# Altium project Sidekick Carrier - Rev. 1.PrjPcb (part 1 of 6)
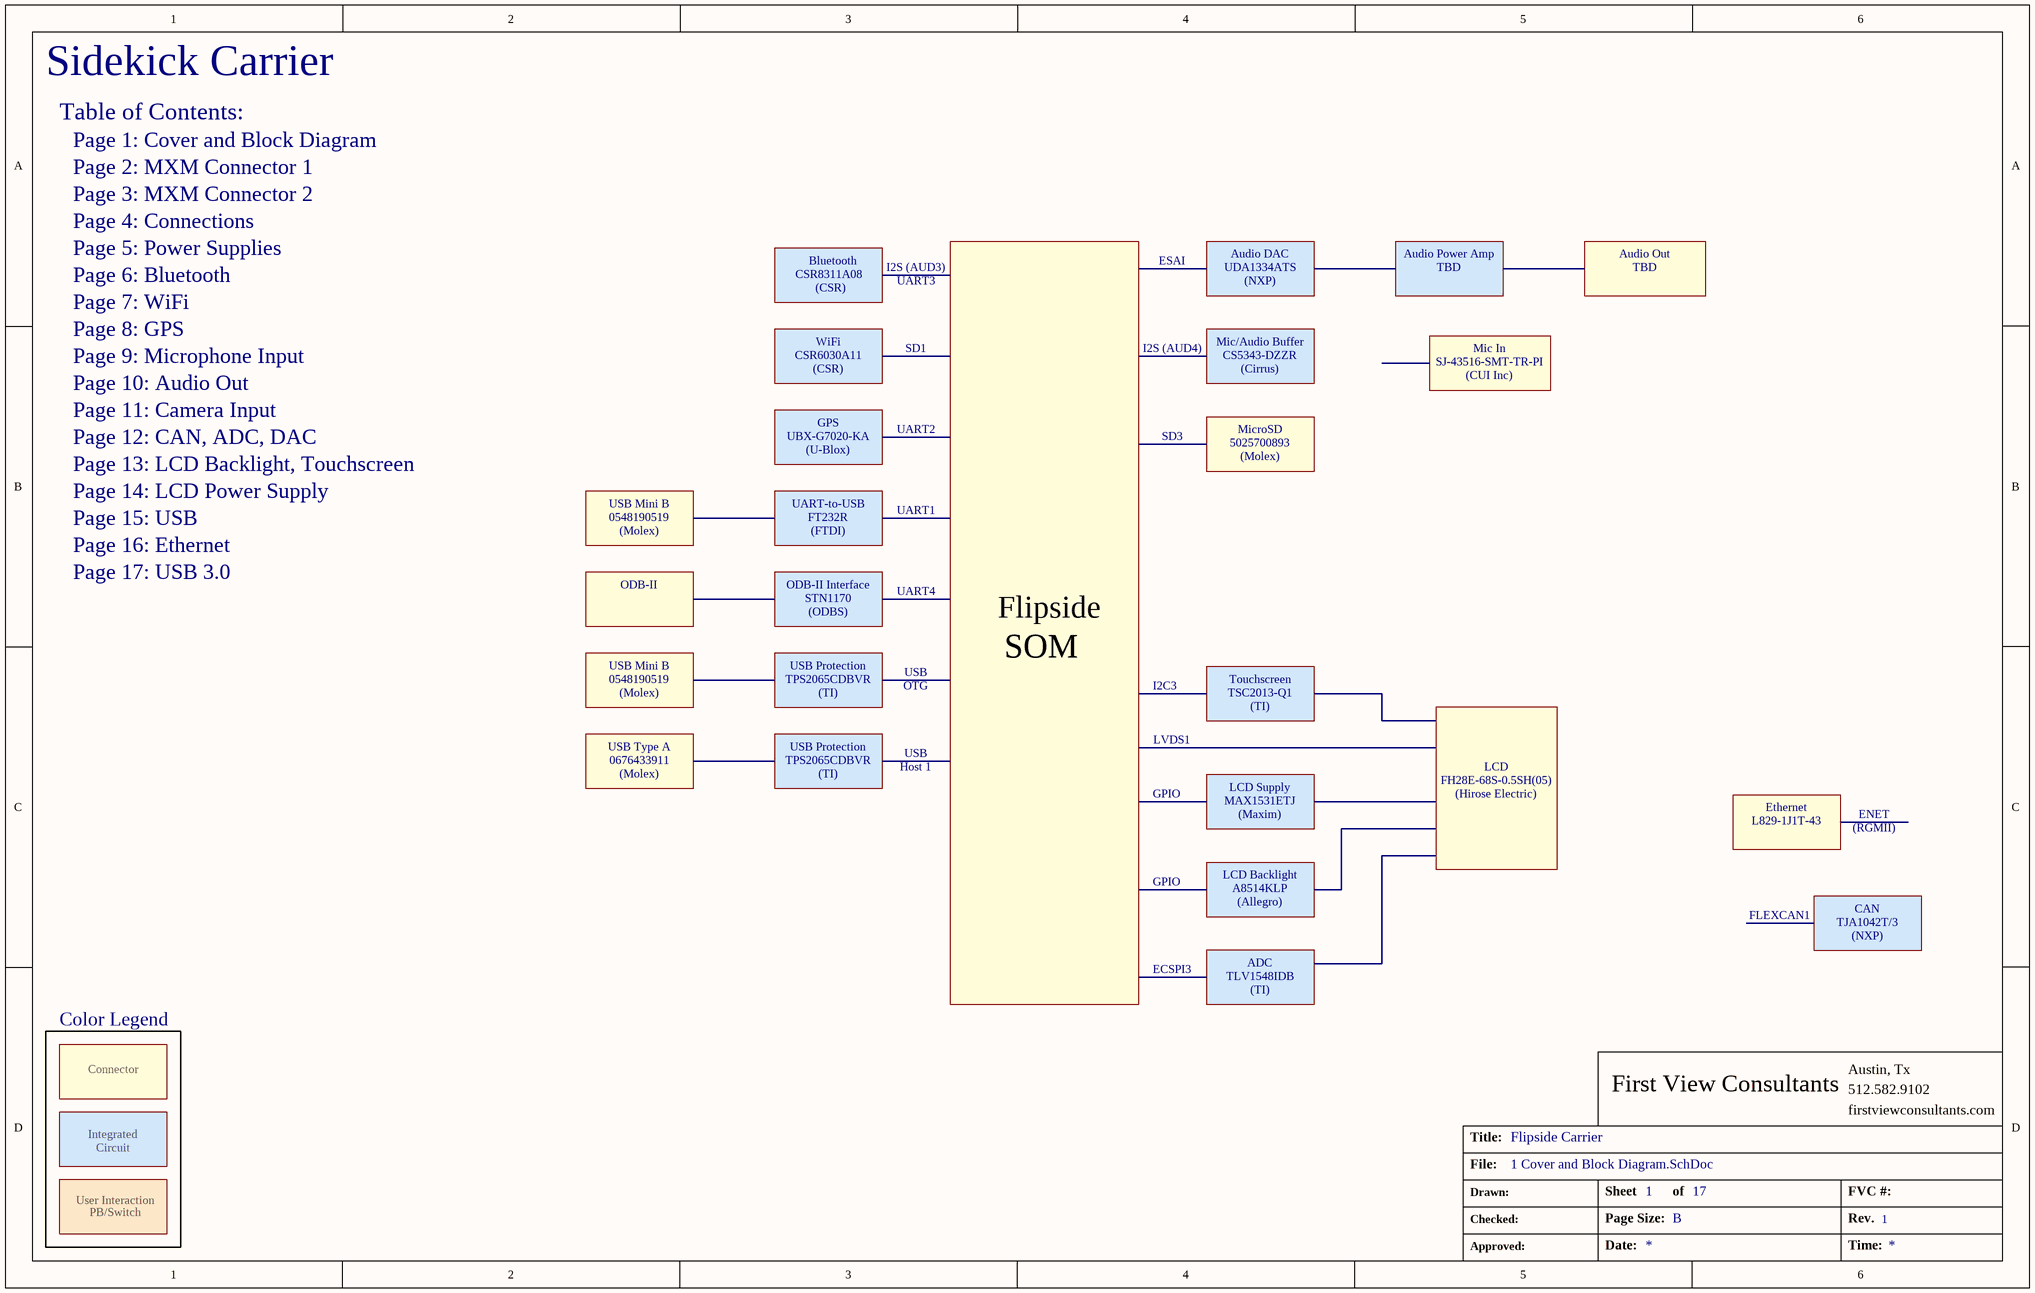
[diagram p0: 1 Cover and Block Diagram.SchDoc]
FV_Project_Title: Flipside Carrier; FV_Revision: 1
17 sheets, 951 parts. Net scope: flat (ports and power ports of the same name join across sheets).
Sheets:
  1 Cover and Block Diagram.SchDoc
  2 MXM Connector 1.SchDoc
  3 MXM Connector 2.SchDoc
  4 Connectors.SchDoc
  5 Power Supplies.SchDoc
  6 Bluetooth.SchDoc
  7 WiFi.SchDoc
  8 GPS.SchDoc
  9 Microphone Input.SchDoc
  10 Audio Out.SchDoc
  11 Camera Input.SchDoc
  12 CAN, ADC, DAC.SchDoc
  13 LCD Backlight, Touchscreen.SchDoc
  14 LCD Power Supply.SchDoc
  15 USB.SchDoc
  16 Ethernet.SchDoc
  17 USB 3.0.SchDoc

## Sheet 1 Cover and Block Diagram.SchDoc: Cover
size B; DocumentNumber: 1; SheetNumber: 1; SheetTotal: 17

### Notes on the sheet
- Sidekick Carrier
- Table of Contents:
- Page 1: Cover and Block Diagram
- Page 2: MXM Connector 1
- Page 4: Connections
- Page 3: MXM Connector 2
- Page 5: Power Supplies
- Page 6: Bluetooth
- CSR8311A08
- Bluetooth
- (CSR)
- I2S (AUD3)
- UART3
- ESAI
- Audio DAC
- UDA1334ATS
- (NXP)
- Audio Power Amp
- TBD
- Audio Out
- Page 7: WiFi
- Page 8: GPS
- Page 9: Microphone Input
- WiFi
- CSR6030A11
- SD1
- I2S (AUD4)
- Mic/Audio Buffer
- CS5343-DZZR
- (Cirrus)
- Mic In
- SJ-43516-SMT-TR-PI
- Page 10: Audio Out
- Page 11: Camera Input
- GPS
- UART2
- MicroSD
- (CUI Inc)
- Page 12: CAN, ADC, DAC
- Page 13: LCD Backlight, Touchscreen
- Page 14: LCD Power Supply
- USB Mini B
- UBX-G7020-KA
- (U-Blox)
- UART-to-USB
- SD3
- 5025700893
- (Molex)
- Page 15: USB
- Page 16: Ethernet
- 0548190519
- FT232R
- (FTDI)
- UART1
- Page 17: USB 3.0
- ODB-II
- ODB-II Interface
- STN1170
- (ODBS)
- UART4
- Flipside
- USB Protection
- TPS2065CDBVR
- (TI)
- USB
- OTG
- SOM
- I2C3
- Touchscreen
- TSC2013-Q1
- USB Type A
- 0676433911
- Host 1
- LVDS1
- LCD
- GPIO
- LCD Supply
- MAX1531ETJ
- (Maxim)
- FH28E-68S-0.5SH(05)
- (Hirose Electric)
- Ethernet
- L829-1J1T-43
- ENET
- (RGMII)
- LCD Backlight
- A8514KLP
- (Allegro)
- CAN
- ECSPI3
- ADC
- FLEXCAN1
- TJA1042T/3
- Color Legend
- TLV1548IDB
- Connector
- Integrated
- Circuit
- User Interaction
- PB/Switch
- First View Consultants
- Austin, Tx
- 512.582.9102
- Title:
- File:
- firstviewconsultants.com
- Drawn:
- Checked:
- Sheet
- Page Size:
- of
- B
- FVC #:
- Rev.
- Approved:
- Date:
- Time:

## Sheet 2 MXM Connector 1.SchDoc: MXM Connector
size C; DocumentNumber: 2; SheetNumber: 2; SheetTotal: 17
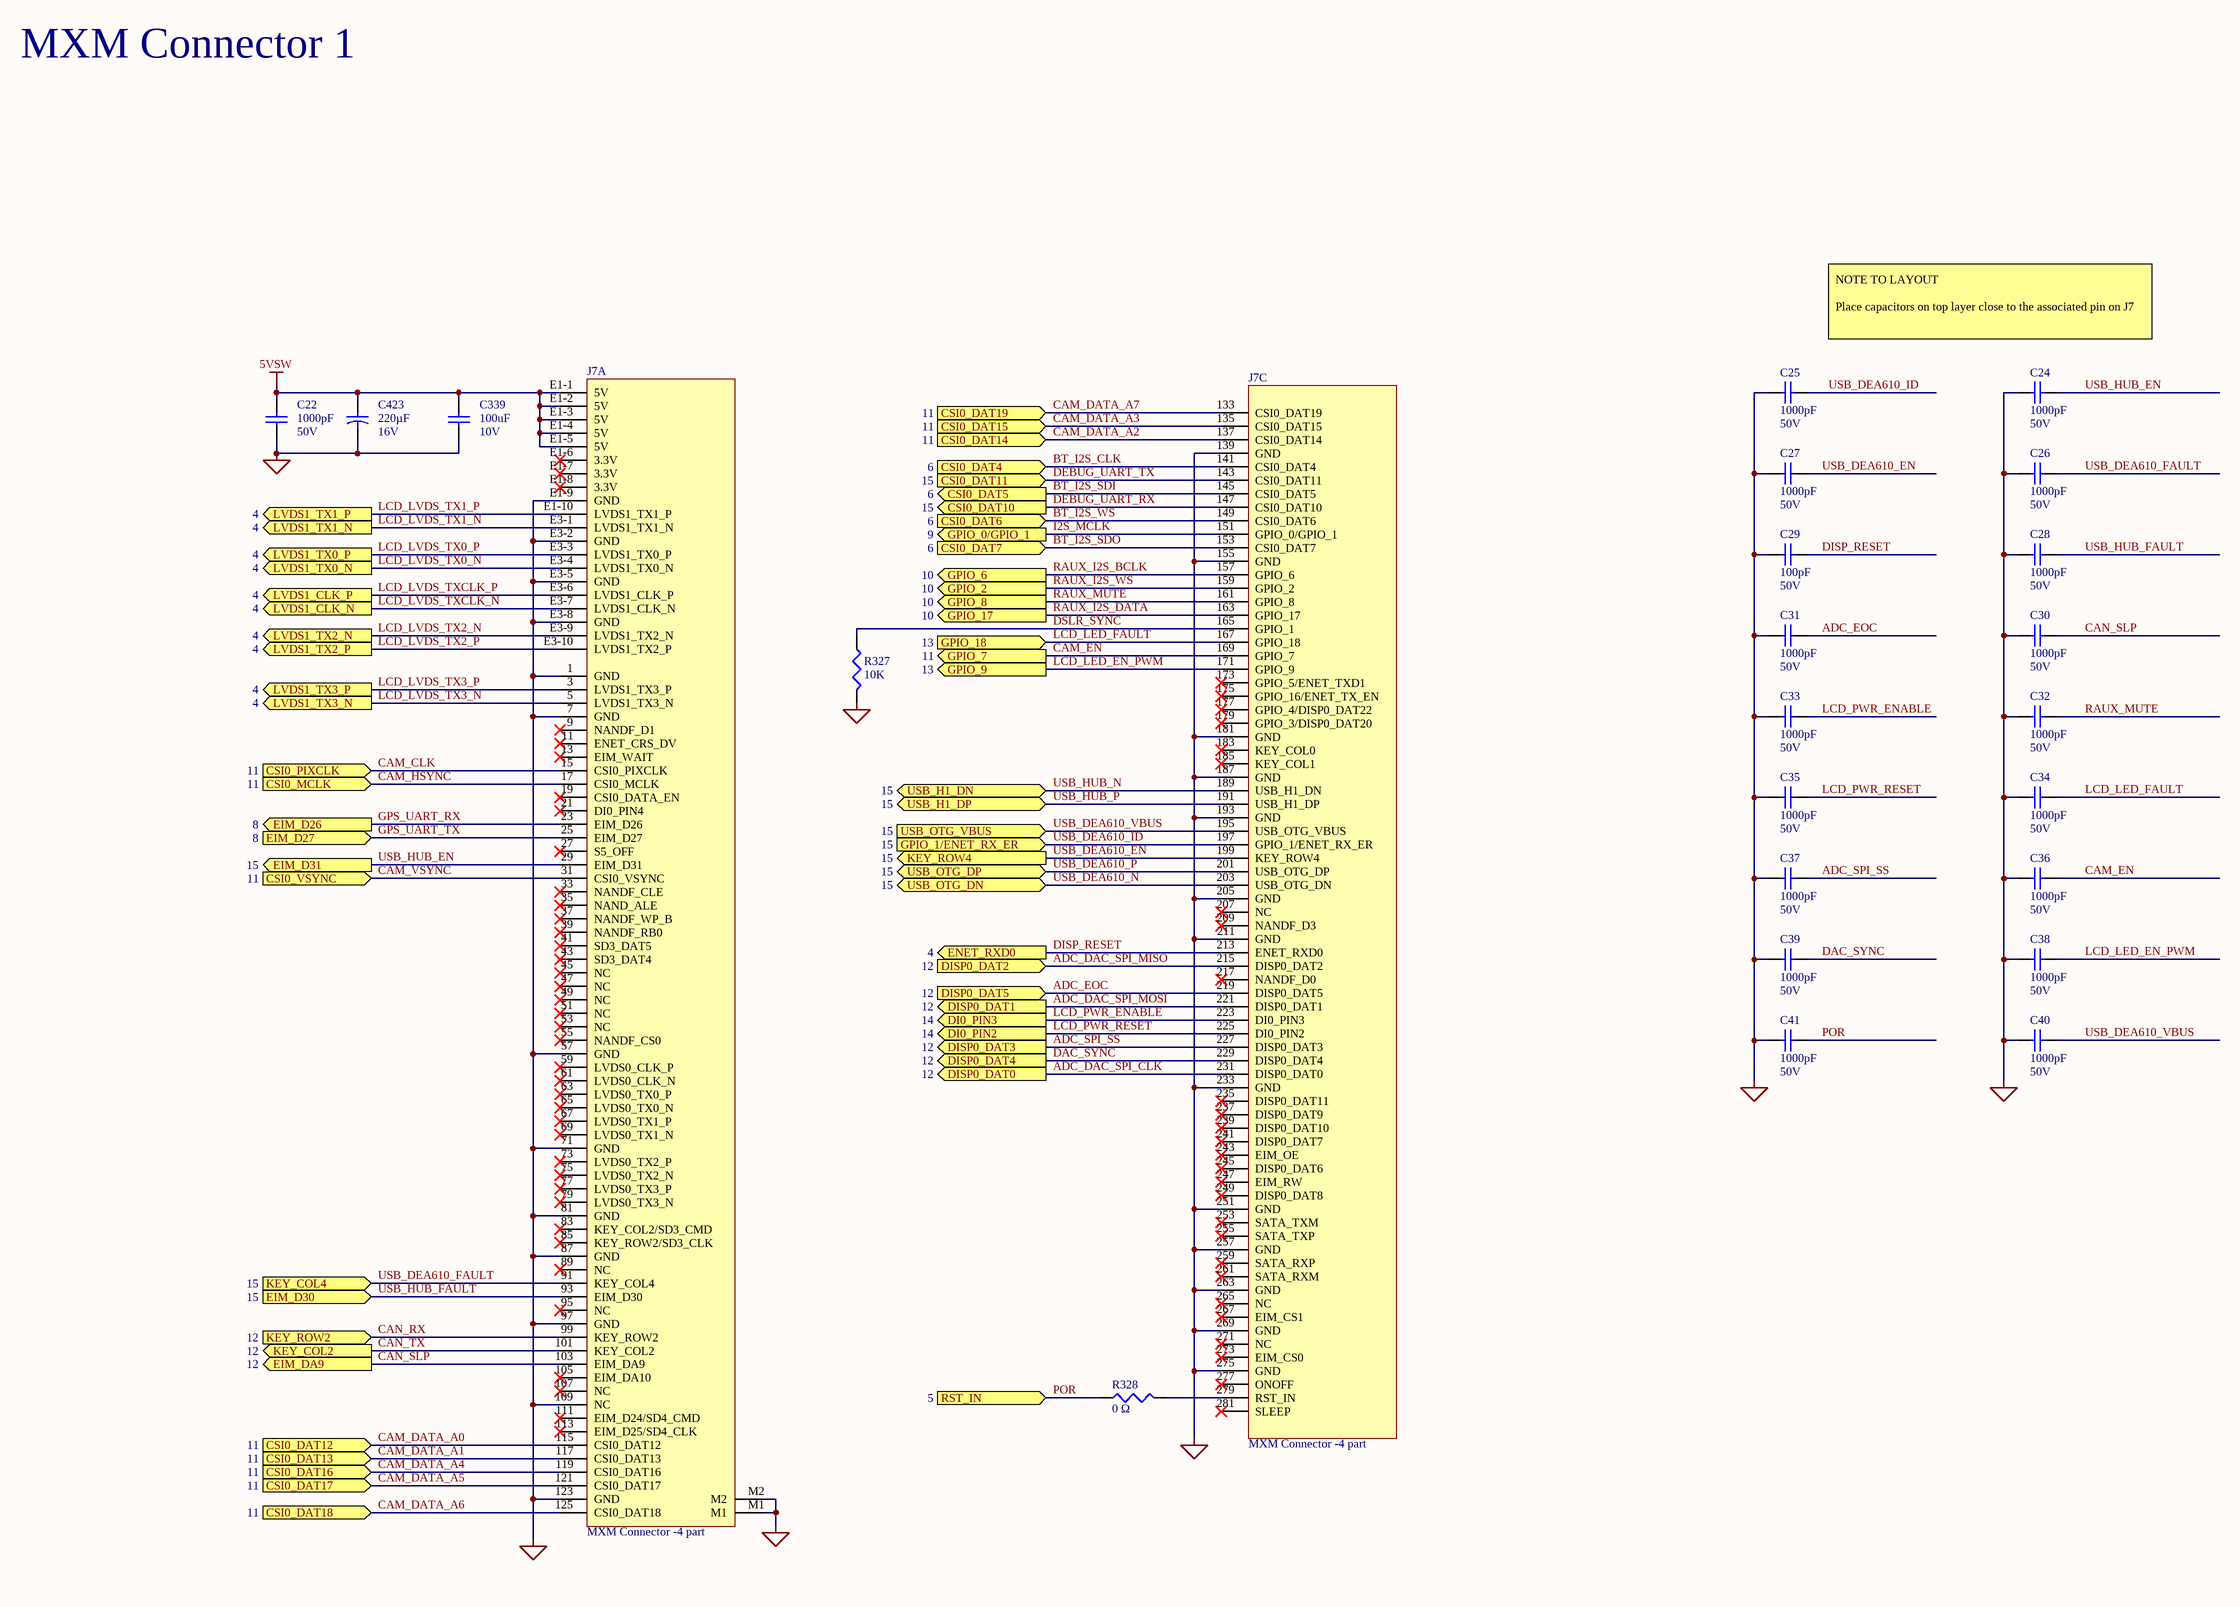
[diagram p1: 2 MXM Connector 1.SchDoc]

### Parts
C22  value 1000pF  Voltage: 50V  [CAP_0402]  (hidden comment: Cap 1000pF 50V 0402)
C24  value 1000pF  Voltage: 50V  [CAP_0402]  (hidden comment: Cap 1000pF 50V 0402)
C25  value 1000pF  Voltage: 50V  [CAP_0402]  (hidden comment: Cap 1000pF 50V 0402)
C26  value 1000pF  Voltage: 50V  [CAP_0402]  (hidden comment: Cap 1000pF 50V 0402)
C27  value 1000pF  Voltage: 50V  [CAP_0402]  (hidden comment: Cap 1000pF 50V 0402)
C28  value 1000pF  Voltage: 50V  [CAP_0402]  (hidden comment: Cap 1000pF 50V 0402)
C29  value 100pF  Voltage: 50V  [CAP_0402]  (hidden comment: Cap 100pF 50V 0402)
C30  value 1000pF  Voltage: 50V  [CAP_0402]  (hidden comment: Cap 1000pF 50V 0402)
C31  value 1000pF  Voltage: 50V  [CAP_0402]  (hidden comment: Cap 1000pF 50V 0402)
C32  value 1000pF  Voltage: 50V  [CAP_0402]  (hidden comment: Cap 1000pF 50V 0402)
C33  value 1000pF  Voltage: 50V  [CAP_0402]  (hidden comment: Cap 1000pF 50V 0402)
C34  value 1000pF  Voltage: 50V  [CAP_0402]  (hidden comment: Cap 1000pF 50V 0402)
C35  value 1000pF  Voltage: 50V  [CAP_0402]  (hidden comment: Cap 1000pF 50V 0402)
C36  value 1000pF  Voltage: 50V  [CAP_0402]  (hidden comment: Cap 1000pF 50V 0402)
C37  value 1000pF  Voltage: 50V  [CAP_0402]  (hidden comment: Cap 1000pF 50V 0402)
C38  value 1000pF  Voltage: 50V  [CAP_0402]  (hidden comment: Cap 1000pF 50V 0402)
C39  value 1000pF  Voltage: 50V  [CAP_0402]  (hidden comment: Cap 1000pF 50V 0402)
C40  value 1000pF  Voltage: 50V  [CAP_0402]  (hidden comment: Cap 1000pF 50V 0402)
C41  value 1000pF  Voltage: 50V  [CAP_0402]  (hidden comment: Cap 1000pF 50V 0402)
C339  value 100uF  Voltage: 10V  [CAP_1210]  (hidden comment: Cap 100uF 10V 1210)
C423  value 220µF  Voltage: 16V  [SMD(6.6x6.6)_UWT1C221MCL1GS]  (hidden comment: Cap 220µF 16V)
J7  MXM Connector -4 part  [CON_CLE9990-0402F]  (parts A,C of 4)
R327  value 10K  [RES_0402]  (hidden comment: Res 10K 0.063W)
R328  value 0 Ω  [RES_0402]  (hidden comment: Res 0 ohm 0.1W)

### Ports
CSI0_DAT4 (in, see 6), CSI0_DAT5 (out, see 6), CSI0_DAT6 (in, see 6), CSI0_DAT7 (in, see 6), CSI0_DAT10 (out, see 15), CSI0_DAT11 (in, see 15), CSI0_DAT12 (in, see 11), CSI0_DAT13 (in, see 11), CSI0_DAT14 (in, see 11), CSI0_DAT15 (in, see 11), CSI0_DAT16 (in, see 11), CSI0_DAT17 (in, see 11), CSI0_DAT18 (in, see 11), CSI0_DAT19 (in, see 11), CSI0_MCLK (in, see 11), CSI0_PIXCLK (in, see 11), CSI0_VSYNC (in, see 11), DI0_PIN2 (out, see 14), DI0_PIN3 (out, see 14), DISP0_DAT0 (out, see 12), DISP0_DAT1 (out, see 12), DISP0_DAT2 (in, see 12), DISP0_DAT3 (out, see 12), DISP0_DAT4 (out, see 12), DISP0_DAT5 (in, see 12), EIM_D26 (out, see 8), EIM_D27 (in, see 8), EIM_D30 (in, see 15), EIM_D31 (out, see 15), EIM_DA9 (out, see 12), ENET_RXD0 (out, see 4), GPIO_0/GPIO_1 (out, see 9), GPIO_1/ENET_RX_ER (in, see 15), GPIO_2 (out, see 10), GPIO_6 (out, see 10), GPIO_7 (out, see 11), GPIO_8 (out, see 10), GPIO_9 (out, see 13), GPIO_17 (out, see 10), GPIO_18 (in, see 13), KEY_COL2 (out, see 12), KEY_COL4 (in, see 15), KEY_ROW2 (in, see 12), KEY_ROW4 (out, see 15), LVDS1_CLK_N (out, see 4), LVDS1_CLK_P (out, see 4), LVDS1_TX0_N (out, see 4), LVDS1_TX0_P (out, see 4), LVDS1_TX1_N (out, see 4), LVDS1_TX1_P (out, see 4), LVDS1_TX2_N (out, see 4), LVDS1_TX2_P (out, see 4), LVDS1_TX3_N (out, see 4), LVDS1_TX3_P (out, see 4), RST_IN (in, see 5), USB_H1_DN (bidir, see 15), USB_H1_DP (bidir, see 15), USB_OTG_DN (bidir, see 15), USB_OTG_DP (bidir, see 15), USB_OTG_VBUS (in, see 15)

### Nets
5VSW: C22.1 C339.1 C423.1 J7.E1-1(5V) J7.E1-2(5V) J7.E1-3(5V) J7.E1-4(5V) J7.E1-5(5V)
GND: C22.2 C24.2 C25.2 C26.2 C27.2 C28.2 C29.2 C30.2 C31.2 C32.2 C33.2 C34.2 C35.2 C36.2 C37.2 C38.2 C39.2 C40.2 C41.2 C339.2 C423.2 J7.1(GND) J7.7(GND) J7.57(GND) J7.71(GND) J7.81(GND) J7.87(GND) J7.97(GND) J7.109(NC) J7.123(GND) J7.139(GND) J7.155(GND) J7.181(GND) J7.187(GND) J7.193(GND) J7.205(GND) J7.211(GND) J7.233(GND) J7.251(GND) J7.257(GND) J7.263(GND) J7.269(GND) J7.275(GND) J7.E1-9(GND) J7.E3-2(GND) J7.E3-5(GND) J7.E3-8(GND) J7.M1 J7.M2 R327.2
ADC_DAC_SPI_CLK: J7.231(DISP0_DAT0) ; port DISP0_DAT0
ADC_DAC_SPI_MISO: J7.215(DISP0_DAT2) ; port DISP0_DAT2
ADC_DAC_SPI_MOSI: J7.221(DISP0_DAT1) ; port DISP0_DAT1
ADC_EOC: C31.1 J7.219(DISP0_DAT5) ; port DISP0_DAT5
ADC_SPI_SS: C37.1 J7.227(DISP0_DAT3) ; port DISP0_DAT3
BT_I2S_CLK: J7.141(CSI0_DAT4) ; port CSI0_DAT4
BT_I2S_SDI: J7.145(CSI0_DAT5) ; port CSI0_DAT5
BT_I2S_SDO: J7.153(CSI0_DAT7) ; port CSI0_DAT7
BT_I2S_WS: J7.149(CSI0_DAT6) ; port CSI0_DAT6
CAM_CLK: J7.15(CSI0_PIXCLK) ; port CSI0_PIXCLK
CAM_DATA_A0: J7.115(CSI0_DAT12) ; port CSI0_DAT12
CAM_DATA_A1: J7.117(CSI0_DAT13) ; port CSI0_DAT13
CAM_DATA_A2: J7.137(CSI0_DAT14) ; port CSI0_DAT14
CAM_DATA_A3: J7.135(CSI0_DAT15) ; port CSI0_DAT15
CAM_DATA_A4: J7.119(CSI0_DAT16) ; port CSI0_DAT16
CAM_DATA_A5: J7.121(CSI0_DAT17) ; port CSI0_DAT17
CAM_DATA_A6: J7.125(CSI0_DAT18) ; port CSI0_DAT18
CAM_DATA_A7: J7.133(CSI0_DAT19) ; port CSI0_DAT19
CAM_EN: C36.1 J7.169(GPIO_7) ; port GPIO_7
CAM_HSYNC: J7.17(CSI0_MCLK) ; port CSI0_MCLK
CAM_VSYNC: J7.31(CSI0_VSYNC) ; port CSI0_VSYNC
CAN_RX: J7.99(KEY_ROW2) ; port KEY_ROW2
CAN_SLP: C30.1 J7.103(EIM_DA9) ; port EIM_DA9
CAN_TX: J7.101(KEY_COL2) ; port KEY_COL2
DAC_SYNC: C39.1 J7.229(DISP0_DAT4) ; port DISP0_DAT4
DEBUG_UART_RX: J7.147(CSI0_DAT10) ; port CSI0_DAT10
DEBUG_UART_TX: J7.143(CSI0_DAT11) ; port CSI0_DAT11
DISP_RESET: C29.1 J7.213(ENET_RXD0) ; port ENET_RXD0
DSLR_SYNC: J7.165(GPIO_1) R327.1
GPS_UART_RX: J7.23(EIM_D26) ; port EIM_D26
GPS_UART_TX: J7.25(EIM_D27) ; port EIM_D27
I2S_MCLK: J7.151(GPIO_0/GPIO_1) ; port GPIO_0/GPIO_1
LCD_LED_EN_PWM: C38.1 J7.171(GPIO_9) ; port GPIO_9
LCD_LED_FAULT: C34.1 J7.167(GPIO_18) ; port GPIO_18
LCD_LVDS_TX0_N: J7.E3-4(LVDS1_TX0_N) ; port LVDS1_TX0_N
LCD_LVDS_TX0_P: J7.E3-3(LVDS1_TX0_P) ; port LVDS1_TX0_P
LCD_LVDS_TX1_N: J7.E3-1(LVDS1_TX1_N) ; port LVDS1_TX1_N
LCD_LVDS_TX1_P: J7.E1-10(LVDS1_TX1_P) ; port LVDS1_TX1_P
LCD_LVDS_TX2_N: J7.E3-9(LVDS1_TX2_N) ; port LVDS1_TX2_N
LCD_LVDS_TX2_P: J7.E3-10(LVDS1_TX2_P) ; port LVDS1_TX2_P
LCD_LVDS_TX3_N: J7.5(LVDS1_TX3_N) ; port LVDS1_TX3_N
LCD_LVDS_TX3_P: J7.3(LVDS1_TX3_P) ; port LVDS1_TX3_P
LCD_LVDS_TXCLK_N: J7.E3-7(LVDS1_CLK_N) ; port LVDS1_CLK_N
LCD_LVDS_TXCLK_P: J7.E3-6(LVDS1_CLK_P) ; port LVDS1_CLK_P
LCD_PWR_ENABLE: C33.1 J7.223(DI0_PIN3) ; port DI0_PIN3
LCD_PWR_RESET: C35.1 J7.225(DI0_PIN2) ; port DI0_PIN2
POR: C41.1 R328.1 ; port RST_IN
RAUX_I2S_BCLK: J7.157(GPIO_6) ; port GPIO_6
RAUX_I2S_DATA: J7.163(GPIO_17) ; port GPIO_17
RAUX_I2S_WS: J7.159(GPIO_2) ; port GPIO_2
RAUX_MUTE: C32.1 J7.161(GPIO_8) ; port GPIO_8
USB_DEA610_EN: C27.1 J7.199(KEY_ROW4) ; port KEY_ROW4
USB_DEA610_FAULT: C26.1 J7.91(KEY_COL4) ; port KEY_COL4
USB_DEA610_ID: C25.1 J7.197(GPIO_1/ENET_RX_ER) ; port GPIO_1/ENET_RX_ER
USB_DEA610_N: J7.203(USB_OTG_DN) ; port USB_OTG_DN
USB_DEA610_P: J7.201(USB_OTG_DP) ; port USB_OTG_DP
USB_DEA610_VBUS: C40.1 J7.195(USB_OTG_VBUS) ; port USB_OTG_VBUS
USB_HUB_EN: C24.1 J7.29(EIM_D31) ; port EIM_D31
USB_HUB_FAULT: C28.1 J7.93(EIM_D30) ; port EIM_D30
USB_HUB_N: J7.189(USB_H1_DN) ; port USB_H1_DN
USB_HUB_P: J7.191(USB_H1_DP) ; port USB_H1_DP
NetJ7_279: J7.279(RST_IN) R328.2

Not connected (* = marked no-connect by the designer): J7 9(NANDF_D1)* 11(ENET_CRS_DV)* 13(EIM_WAIT)* 19(CSI0_DATA_EN)* 21(DI0_PIN4)* 27(S5_OFF)* 33(NANDF_CLE)* 35(NAND_ALE)* 37(NANDF_WP_B)* 39(NANDF_RB0)* 41(SD3_DAT5)* 43(SD3_DAT4)* 45(NC)* 47(NC)* 49(NC)* 51(NC)* 53(NC)* 55(NANDF_CS0)* 59(LVDS0_CLK_P)* 61(LVDS0_CLK_N)* 63(LVDS0_TX0_P)* 65(LVDS0_TX0_N)* 67(LVDS0_TX1_P)* 69(LVDS0_TX1_N)* 73(LVDS0_TX2_P)* 75(LVDS0_TX2_N)* 77(LVDS0_TX3_P)* 79(LVDS0_TX3_N)* 83(KEY_COL2/SD3_CMD)* 85(KEY_ROW2/SD3_CLK)* 89(NC)* 95(NC)* 105(EIM_DA10)* 107(NC)* 111(EIM_D24/SD4_CMD)* 113(EIM_D25/SD4_CLK)* 173(GPIO_5/ENET_TXD1)* 175(GPIO_16/ENET_TX_EN)* 177(GPIO_4/DISP0_DAT22)* 179(GPIO_3/DISP0_DAT20)* 183(KEY_COL0)* 185(KEY_COL1)* 207(NC)* 209(NANDF_D3)* 217(NANDF_D0)* 235(DISP0_DAT11)* 237(DISP0_DAT9)* 239(DISP0_DAT10)* 241(DISP0_DAT7)* 243(EIM_OE)* 245(DISP0_DAT6)* 247(EIM_RW)* 249(DISP0_DAT8)* 253(SATA_TXM)* 255(SATA_TXP)* 259(SATA_RXP)* 261(SATA_RXM)* 265(NC)* 267(EIM_CS1)* 271(NC)* 273(EIM_CS0)* 277(ONOFF)* 281(SLEEP)* E1-6(3.3V)* E1-7(3.3V)* E1-8(3.3V)*

### Notes on the sheet
- MXM Connector 1
- NOTE TO LAYOUT
  Place capacitors on top layer close to the associated pin on J7
- First View Consultants
- Austin, Tx
- 512.582.9102
- firstviewconsultants.com
- Title:
- File:
- Drawn:
- Sheet
- of
- FVC #:
- Checked:
- Approved:
- Date:
- Page Size:
- C
- Rev.
- Time:

### Library data of the parts
C22 C24-C28 C30-C41 = Cap 1000pF 50V 0402: Cap, Cer, 1000pF, 50V, 20%, X7R, 0402; Manufacturer: Murata Electronics North America; Manufacturer #: GRM155R71H102KA01D; Have Footprint: yes; Tolerance: 20%; PACKAGE: 0402
C29 = Cap 100pF 50V 0402: Cap, Cer, 100pF, 50V, 5%, C0G/NP0, 0402; Manufacturer #: CC0402JRNPO9BN101; Manufacturer: Yageo; Have Footprint: yes; PACKAGE: 0402; Tolerance: 5%
C339 = Cap 100uF 10V 1210: Cap, Cer, 100uF, 10V, 20%, X5R, 1210; Manufacturer #: C1210C107M8PACTU; Manufacturer: Kemet; Package: 1210
C423 = Cap 220µF 16V: Cap, Alum, 220µF, 16V, 20%, SMD; Manufacturer #: UWT1C221MCL1GS; Manufacturer: Nichicon; Tolerance: 20%; Package: SMD  (6.6x6.6); Operating Temperature: -55°C ~ 105°C
J7 = MXM Connector -4 part: Conn, 314-pin, SOM i.MX6, SMD; Manufacturer #: CLE9990-0402F; Manufacturer: SMK Electronics; Operating Temperature: -40℃ ~ +105℃
R327 = Res 10K 0.063W: Res, 10K, 1/16W, 1%, 0402; Manufacturer #: RC0402FR-0710KL; Manufacturer: Yageo; Have Footprint: yes; Package: 0402
R328 = Res 0 ohm 0.1W: Res, 0 ohm, 1/16W, 0402; Manufacturer #: CRCW04020000Z0ED; Manufacturer: Vishay Dale; Have Footprint: yes; Package: 0402

## Sheet 3 MXM Connector 2.SchDoc: MXM Connector
size C; DocumentNumber: 3; SheetNumber: 3; SheetTotal: 17
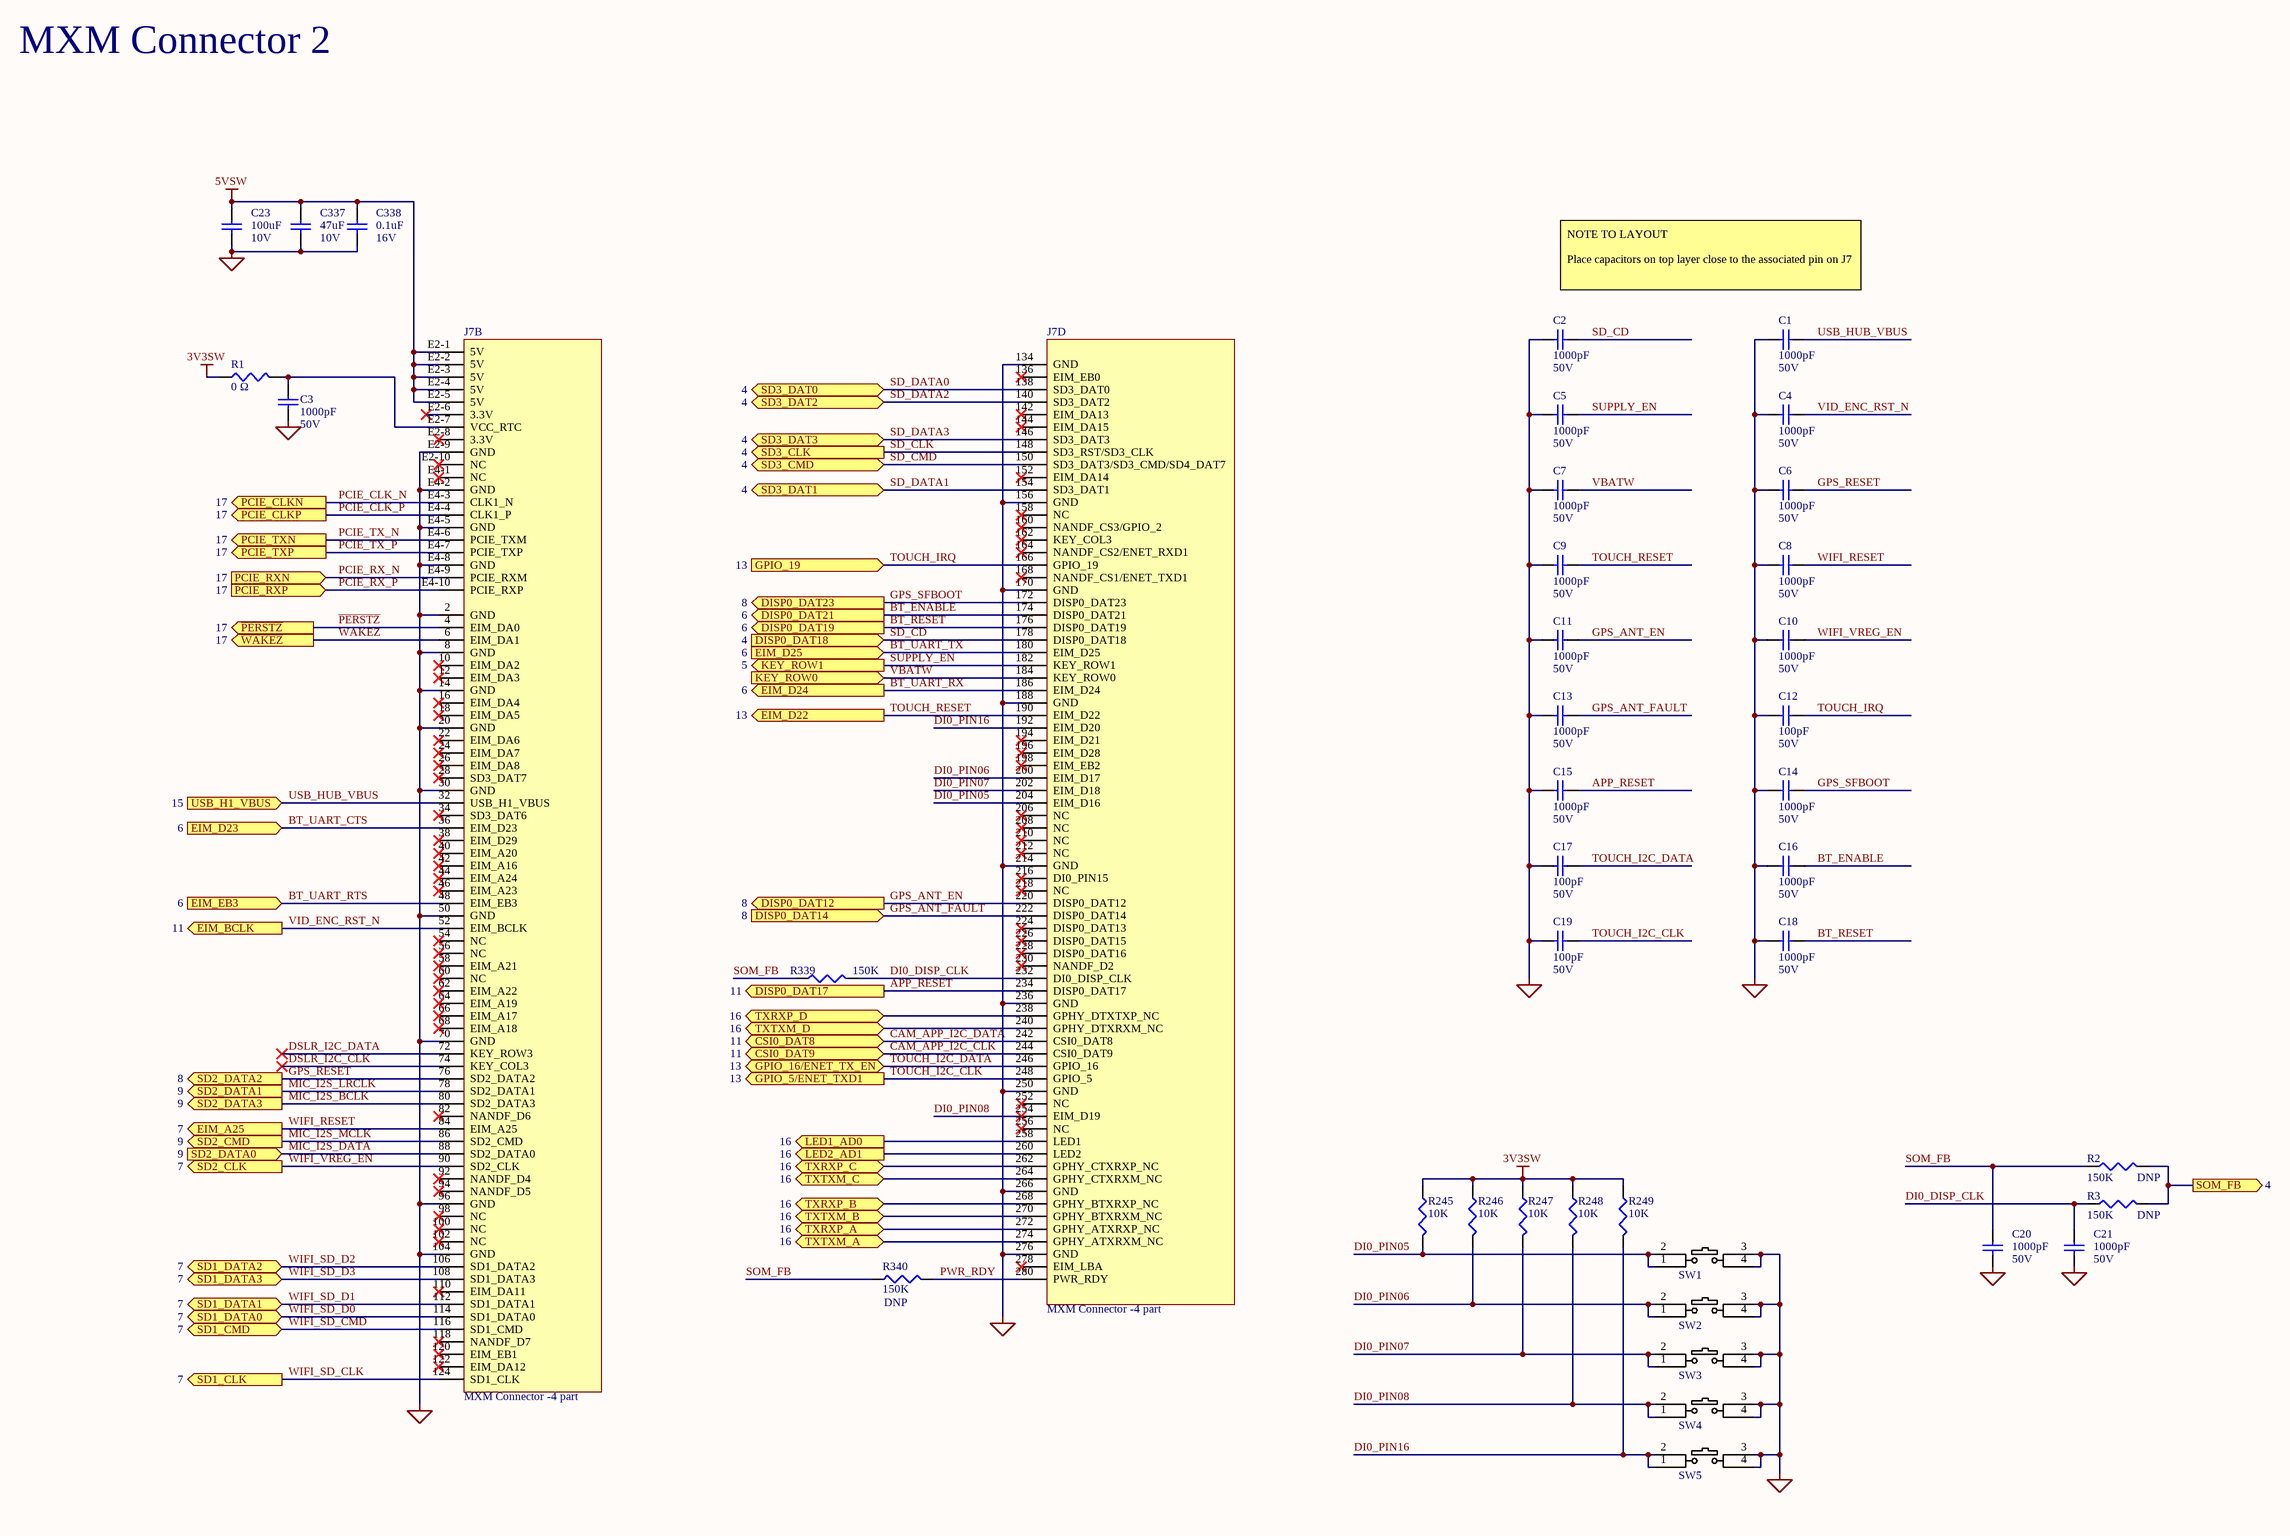
[diagram p2: 3 MXM Connector 2.SchDoc]

### Parts
C1  value 1000pF  Voltage: 50V  [CAP_0402]  (hidden comment: Cap 1000pF 50V 0402)
C2  value 1000pF  Voltage: 50V  [CAP_0402]  (hidden comment: Cap 1000pF 50V 0402)
C3  value 1000pF  Voltage: 50V  [CAP_0402]  (hidden comment: Cap 1000pF 50V 0402)
C4  value 1000pF  Voltage: 50V  [CAP_0402]  (hidden comment: Cap 1000pF 50V 0402)
C5  value 1000pF  Voltage: 50V  [CAP_0402]  (hidden comment: Cap 1000pF 50V 0402)
C6  value 1000pF  Voltage: 50V  [CAP_0402]  (hidden comment: Cap 1000pF 50V 0402)
C7  value 1000pF  Voltage: 50V  [CAP_0402]  (hidden comment: Cap 1000pF 50V 0402)
C8  value 1000pF  Voltage: 50V  [CAP_0402]  (hidden comment: Cap 1000pF 50V 0402)
C9  value 1000pF  Voltage: 50V  [CAP_0402]  (hidden comment: Cap 1000pF 50V 0402)
C10  value 1000pF  Voltage: 50V  [CAP_0402]  (hidden comment: Cap 1000pF 50V 0402)
C11  value 1000pF  Voltage: 50V  [CAP_0402]  (hidden comment: Cap 1000pF 50V 0402)
C12  value 100pF  Voltage: 50V  [CAP_0402]  (hidden comment: Cap 100pF 50V 0402)
C13  value 1000pF  Voltage: 50V  [CAP_0402]  (hidden comment: Cap 1000pF 50V 0402)
C14  value 1000pF  Voltage: 50V  [CAP_0402]  (hidden comment: Cap 1000pF 50V 0402)
C15  value 1000pF  Voltage: 50V  [CAP_0402]  (hidden comment: Cap 1000pF 50V 0402)
C16  value 1000pF  Voltage: 50V  [CAP_0402]  (hidden comment: Cap 1000pF 50V 0402)
C17  value 100pF  Voltage: 50V  [CAP_0402]  (hidden comment: Cap 100pF 50V 0402)
C18  value 1000pF  Voltage: 50V  [CAP_0402]  (hidden comment: Cap 1000pF 50V 0402)
C19  value 100pF  Voltage: 50V  [CAP_0402]  (hidden comment: Cap 100pF 50V 0402)
C20  value 1000pF  Voltage: 50V  [CAP_0402]  (hidden comment: Cap 1000pF 50V 0402)
C21  value 1000pF  Voltage: 50V  [CAP_0402]  (hidden comment: Cap 1000pF 50V 0402)
C23  value 100uF  Voltage: 10V  [CAP_1210]  (hidden comment: Cap 100uF 10V 1210)
C337  value 47uF  Voltage: 10V  [CAP_1206]  (hidden comment: Cap 47uF 10V 1206)
C338  value 0.1uF  Voltage: 16V  [CAP_0402]  (hidden comment: Cap 0.1uF 16V 0402)
J7  MXM Connector -4 part  [CON_CLE9990-0402F]  (parts B,D of 4)
R1  value 0 Ω  [RES_0402]  (hidden comment: Res 0 ohm 0.1W)
R2  value 150K  [RES_0402]  (hidden comment: Res 150K 0.063W)
R3  value 150K  [RES_0402]  (hidden comment: Res 150K 0.063W)
R245  value 10K  [RES_0402]  (hidden comment: Res 10K 0.063W)
R246  value 10K  [RES_0402]  (hidden comment: Res 10K 0.063W)
R247  value 10K  [RES_0402]  (hidden comment: Res 10K 0.063W)
R248  value 10K  [RES_0402]  (hidden comment: Res 10K 0.063W)
R249  value 10K  [RES_0402]  (hidden comment: Res 10K 0.063W)
R339  value 150K  [RES_0402]  (hidden comment: Res 150K 0.063W)
R340  value 150K  [RES_0402]  (hidden comment: Res 150K 0.063W)
SW1  PTS645SH50SMTR92 LFS  [SW_PTS645SH50SMTR92]  (value not drawn)
SW2  PTS645SH50SMTR92 LFS  [SW_PTS645SH50SMTR92]  (value not drawn)
SW3  PTS645SH50SMTR92 LFS  [SW_PTS645SH50SMTR92]  (value not drawn)
SW4  PTS645SH50SMTR92 LFS  [SW_PTS645SH50SMTR92]  (value not drawn)
SW5  PTS645SH50SMTR92 LFS  [SW_PTS645SH50SMTR92]  (value not drawn)

### Ports
CSI0_DAT8 (bidir, see 11), CSI0_DAT9 (bidir, see 11), DISP0_DAT12 (out, see 8), DISP0_DAT14 (in, see 8), DISP0_DAT17 (out, see 11), DISP0_DAT18 (in, see 4), DISP0_DAT19 (out, see 6), DISP0_DAT21 (out, see 6), DISP0_DAT23 (out, see 8), EIM_A25 (out, see 7), EIM_BCLK (out, see 11), EIM_D22 (out, see 13), EIM_D23 (in, see 6), EIM_D24 (out, see 6), EIM_D25 (in, see 6), EIM_EB3 (in, see 6), GPIO_5/ENET_TXD1 (out, see 13), GPIO_16/ENET_TX_EN (bidir, see 13), GPIO_19 (in, see 13), KEY_ROW0 (in), KEY_ROW1 (out, see 5), LED1_AD0 (out, see 16), LED2_AD1 (out, see 16), PCIE_CLKN (out, see 17), PCIE_CLKP (out, see 17), PCIE_RXN (in, see 17), PCIE_RXP (in, see 17), PCIE_TXN (out, see 17), PCIE_TXP (out, see 17), SD1_CLK (out, see 7), SD1_CMD (bidir, see 7), SD1_DATA0 (bidir, see 7), SD1_DATA1 (bidir, see 7), SD1_DATA2 (bidir, see 7), SD1_DATA3 (bidir, see 7), SD2_CLK (out, see 7), SD2_CMD (out, see 9), SD2_DATA0 (in, see 9), SD2_DATA1 (out, see 9), SD2_DATA2 (out, see 8), SD2_DATA3 (out, see 9), SD3_CLK (out, see 4), SD3_CMD (bidir, see 4), SD3_DAT0 (bidir, see 4), SD3_DAT1 (bidir, see 4), SD3_DAT2 (bidir, see 4), SD3_DAT3 (bidir, see 4), SOM_FB (out, see 4), TXRXP_A (bidir, see 16), TXRXP_B (bidir, see 16), TXRXP_C (bidir, see 16), TXRXP_D (bidir, see 16), TXTXM_A (bidir, see 16), TXTXM_B (bidir, see 16), TXTXM_C (bidir, see 16), TXTXM_D (bidir, see 16), USB_H1_VBUS (in, see 15), ~{PERSTZ} (out, see 17), ~{WAKEZ} (out, see 17)

### Nets
3V3SW: R1.1 R245.1 R246.1 R247.1 R248.1 R249.1
5VSW: C23.1 C337.1 C338.1 J7.E2-1(5V) J7.E2-2(5V) J7.E2-3(5V) J7.E2-4(5V) J7.E2-5(5V)
GND: C1.2 C2.2 C3.2 C4.2 C5.2 C6.2 C7.2 C8.2 C9.2 C10.2 C11.2 C12.2 C13.2 C14.2 C15.2 C16.2 C17.2 C18.2 C19.2 C20.2 C21.2 C23.2 C337.2 C338.2 J7.2(GND) J7.8(GND) J7.14(GND) J7.20(GND) J7.30(GND) J7.50(GND) J7.70(GND) J7.96(GND) J7.104(GND) J7.134(GND) J7.156(GND) J7.170(GND) J7.188(GND) J7.214(GND) J7.236(GND) J7.250(GND) J7.266(GND) J7.276(GND) J7.E2-9(GND) J7.E4-2(GND) J7.E4-5(GND) J7.E4-8(GND) SW1.3 SW1.4 SW2.3 SW2.4 SW3.3 SW3.4 SW4.3 SW4.4 SW5.3 SW5.4
APP_RESET: C15.1 J7.234(DISP0_DAT17) ; port DISP0_DAT17
BT_ENABLE: C16.1 J7.174(DISP0_DAT21) ; port DISP0_DAT21
BT_RESET: C18.1 J7.176(DISP0_DAT19) ; port DISP0_DAT19
BT_UART_CTS: J7.36(EIM_D23) ; port EIM_D23
BT_UART_RTS: J7.48(EIM_EB3) ; port EIM_EB3
BT_UART_RX: J7.186(EIM_D24) ; port EIM_D24
BT_UART_TX: J7.180(EIM_D25) ; port EIM_D25
CAM_APP_I2C_CLK: J7.244(CSI0_DAT9) ; port CSI0_DAT9
CAM_APP_I2C_DATA: J7.242(CSI0_DAT8) ; port CSI0_DAT8
DI0_DISP_CLK: C21.1 J7.232(DI0_DISP_CLK) R3.1 R339.2
DI0_PIN05: J7.204(EIM_D16) R245.2 SW1.1 SW1.2
DI0_PIN06: J7.200(EIM_D17) R246.2 SW2.1 SW2.2
DI0_PIN07: J7.202(EIM_D18) R247.2 SW3.1 SW3.2
DI0_PIN08: J7.254(EIM_D19) R248.2 SW4.1 SW4.2
DI0_PIN16: J7.192(EIM_D20) R249.2 SW5.1 SW5.2
DSLR_I2C_CLK: J7.74(KEY_COL3)
DSLR_I2C_DATA: J7.72(KEY_ROW3)
GPS_ANT_EN: C11.1 J7.220(DISP0_DAT12) ; port DISP0_DAT12
GPS_ANT_FAULT: C13.1 J7.222(DISP0_DAT14) ; port DISP0_DAT14
GPS_RESET: C6.1 J7.76(SD2_DATA2) ; port SD2_DATA2
GPS_SFBOOT: C14.1 J7.172(DISP0_DAT23) ; port DISP0_DAT23
MIC_I2S_BCLK: J7.80(SD2_DATA3) ; port SD2_DATA3
MIC_I2S_DATA: J7.88(SD2_DATA0) ; port SD2_DATA0
MIC_I2S_LRCLK: J7.78(SD2_DATA1) ; port SD2_DATA1
MIC_I2S_MCLK: J7.86(SD2_CMD) ; port SD2_CMD
~{PERSTZ}: J7.4(EIM_DA0) ; port ~{PERSTZ}
PCIE_CLK_N: J7.E4-3(CLK1_N) ; port PCIE_CLKN
PCIE_CLK_P: J7.E4-4(CLK1_P) ; port PCIE_CLKP
PCIE_RX_N: J7.E4-9(PCIE_RXM) ; port PCIE_RXN
PCIE_RX_P: J7.E4-10(PCIE_RXP) ; port PCIE_RXP
PCIE_TX_N: J7.E4-6(PCIE_TXM) ; port PCIE_TXN
PCIE_TX_P: J7.E4-7(PCIE_TXP) ; port PCIE_TXP
PWR_RDY: J7.280(PWR_RDY) R340.2
SD_CD: C2.1 J7.178(DISP0_DAT18) ; port DISP0_DAT18
SD_CLK: J7.148(SD3_RST/SD3_CLK) ; port SD3_CLK
SD_CMD: J7.150(SD3_DAT3/SD3_CMD/SD4_DAT7) ; port SD3_CMD
SD_DATA0: J7.138(SD3_DAT0) ; port SD3_DAT0
SD_DATA1: J7.154(SD3_DAT1) ; port SD3_DAT1
SD_DATA2: J7.140(SD3_DAT2) ; port SD3_DAT2
SD_DATA3: J7.146(SD3_DAT3) ; port SD3_DAT3
SOM_FB: C20.1 R2.1 R339.1 R340.1
SUPPLY_EN: C5.1 J7.182(KEY_ROW1) ; port KEY_ROW1
TOUCH_I2C_CLK: C19.1 J7.248(GPIO_5) ; port GPIO_5/ENET_TXD1
TOUCH_I2C_DATA: C17.1 J7.246(GPIO_16) ; port GPIO_16/ENET_TX_EN
TOUCH_IRQ: C12.1 J7.166(GPIO_19) ; port GPIO_19
TOUCH_RESET: C9.1 J7.190(EIM_D22) ; port EIM_D22
TRD1_N: J7.274(GPHY_ATXRXM_NC) ; port TXTXM_A
TRD1_P: J7.272(GPHY_ATXRXP_NC) ; port TXRXP_A
TRD2_N: J7.270(GPHY_BTXRXM_NC) ; port TXTXM_B
TRD2_P: J7.268(GPHY_BTXRXP_NC) ; port TXRXP_B
TRD3_N: J7.264(GPHY_CTXRXM_NC) ; port TXTXM_C
TRD3_P: J7.262(GPHY_CTXRXP_NC) ; port TXRXP_C
TRD4_N: J7.240(GPHY_DTXRXM_NC) ; port TXTXM_D
TRD4_P: J7.238(GPHY_DTXTXP_NC) ; port TXRXP_D
USB_HUB_VBUS: C1.1 J7.32(USB_H1_VBUS) ; port USB_H1_VBUS
VBATW: C7.1 J7.184(KEY_ROW0) ; port KEY_ROW0
VID_ENC_RST_N: C4.1 J7.52(EIM_BCLK) ; port EIM_BCLK
~{WAKEZ}: J7.6(EIM_DA1) ; port ~{WAKEZ}
WIFI_RESET: C8.1 J7.84(EIM_A25) ; port EIM_A25
WIFI_SD_CLK: J7.124(SD1_CLK) ; port SD1_CLK
WIFI_SD_CMD: J7.116(SD1_CMD) ; port SD1_CMD
WIFI_SD_D0: J7.114(SD1_DATA0) ; port SD1_DATA0
WIFI_SD_D1: J7.112(SD1_DATA1) ; port SD1_DATA1
WIFI_SD_D2: J7.106(SD1_DATA2) ; port SD1_DATA2
WIFI_SD_D3: J7.108(SD1_DATA3) ; port SD1_DATA3
WIFI_VREG_EN: C10.1 J7.90(SD2_CLK) ; port SD2_CLK
NetC3_1: C3.1 J7.E2-7(VCC_RTC) R1.2
NetC51_1: R2.2 R3.2 ; port SOM_FB
NetJ7_258: J7.258(LED1) ; port LED1_AD0
NetJ7_260: J7.260(LED2) ; port LED2_AD1

Not connected (* = marked no-connect by the designer): J7 10(EIM_DA2)* 12(EIM_DA3)* 16(EIM_DA4)* 18(EIM_DA5)* 22(EIM_DA6)* 24(EIM_DA7)* 26(EIM_DA8)* 28(SD3_DAT7)* 34(SD3_DAT6)* 38(EIM_D29)* 40(EIM_A20)* 42(EIM_A16)* 44(EIM_A24)* 46(EIM_A23)* 54(NC)* 56(NC)* 58(EIM_A21)* 60(NC)* 62(EIM_A22)* 64(EIM_A19)* 66(EIM_A17)* 68(EIM_A18)* 82(NANDF_D6)* 92(NANDF_D4)* 94(NANDF_D5)* 98(NC)* 100(NC)* 102(NC)* 110(EIM_DA11)* 118(NANDF_D7)* 120(EIM_EB1)* 122(EIM_DA12)* 136(EIM_EB0)* 142(EIM_DA13)* 144(EIM_DA15)* 152(EIM_DA14)* 158(NC)* 160(NANDF_CS3/GPIO_2)* 162(KEY_COL3)* 164(NANDF_CS2/ENET_RXD1)* 168(NANDF_CS1/ENET_TXD1)* 194(EIM_D21)* 196(EIM_D28)* 198(EIM_EB2)* 206(NC)* 208(NC)* 210(NC)* 212(NC)* 216(DI0_PIN15)* 218(NC)* 224(DISP0_DAT13)* 226(DISP0_DAT15)* 228(DISP0_DAT16)* 230(NANDF_D2)* 252(NC)* 256(NC)* 278(EIM_LBA)* E2-6(3.3V)* E2-8(3.3V)* E2-10(NC)* E4-1(NC)*

### Notes on the sheet
- MXM Connector 2
- NOTE TO LAYOUT
  Place capacitors on top layer close to the associated pin on J7
- First View Consultants
- Austin, Tx
- 512.582.9102
- firstviewconsultants.com
- Title:
- File:
- Drawn:
- Sheet
- of
- FVC #:
- Checked:
- Approved:
- Date:
- Page Size:
- C
- Rev.
- Time:

### Library data of the parts
C1-C11 C13-C16 C18 C20 C21 = Cap 1000pF 50V 0402: as C22 on sheet 2 MXM Connector 1; Tolerance: 20%; PACKAGE: 0402
C12 C17 C19 = Cap 100pF 50V 0402: as C29 on sheet 2 MXM Connector 1; PACKAGE: 0402; Tolerance: 5%
C23 = Cap 100uF 10V 1210: as C339 on sheet 2 MXM Connector 1; Package: 1210
C337 = Cap 47uF 10V 1206: Cap, Cer, 47uF, 10V, 20%, X5R, 1206; Manufacturer #: GRM31CR61A476ME15L; Manufacturer: Murata Electronics North America; Tolerance: ±10%; Have Footprint: yes; Package: 1206
C338 = Cap 0.1uF 16V 0402: Cap, Cer, 0.1uF, 16V, 10%, X7R, 0402; Manufacturer #: GRM155R71C104KA88D; Manufacturer: Murata Electronics North America; Have Footprint: yes; Package: 0402; Tolerance: ±10%
J7 = MXM Connector -4 part: as J7 on sheet 2 MXM Connector 1; Operating Temperature: -40℃ ~ +105℃
R1 = Res 0 ohm 0.1W: as R328 on sheet 2 MXM Connector 1; Package: 0402
R2 R3 R339 R340 = Res 150K 0.063W: Res, 150K, 0.063W, 1%, 0402; Manufacturer #: MCR01MRTF1503; Manufacturer: Rohm Semiconductor; Have Footprint: yes; Package: 0402; Tolerance: 1%
  R2 R3 R340: DNP: DNP
R245-R249 = Res 10K 0.063W: as R327 on sheet 2 MXM Connector 1; Package: 0402
SW1-SW5 = PTS645SH50SMTR92 LFS: Switch, Tact, SPST-NO, 0.05A, 12V, SMD; Manufacturer: C&K Components; Have Footprint: yes; Cost: 0.25; Value: *; Manufacturer #: PTS645SH50SMTR92 LFS

## Sheet 4 Connectors.SchDoc
size C; DocumentNumber: 4; SheetNumber: 4; SheetTotal: 17
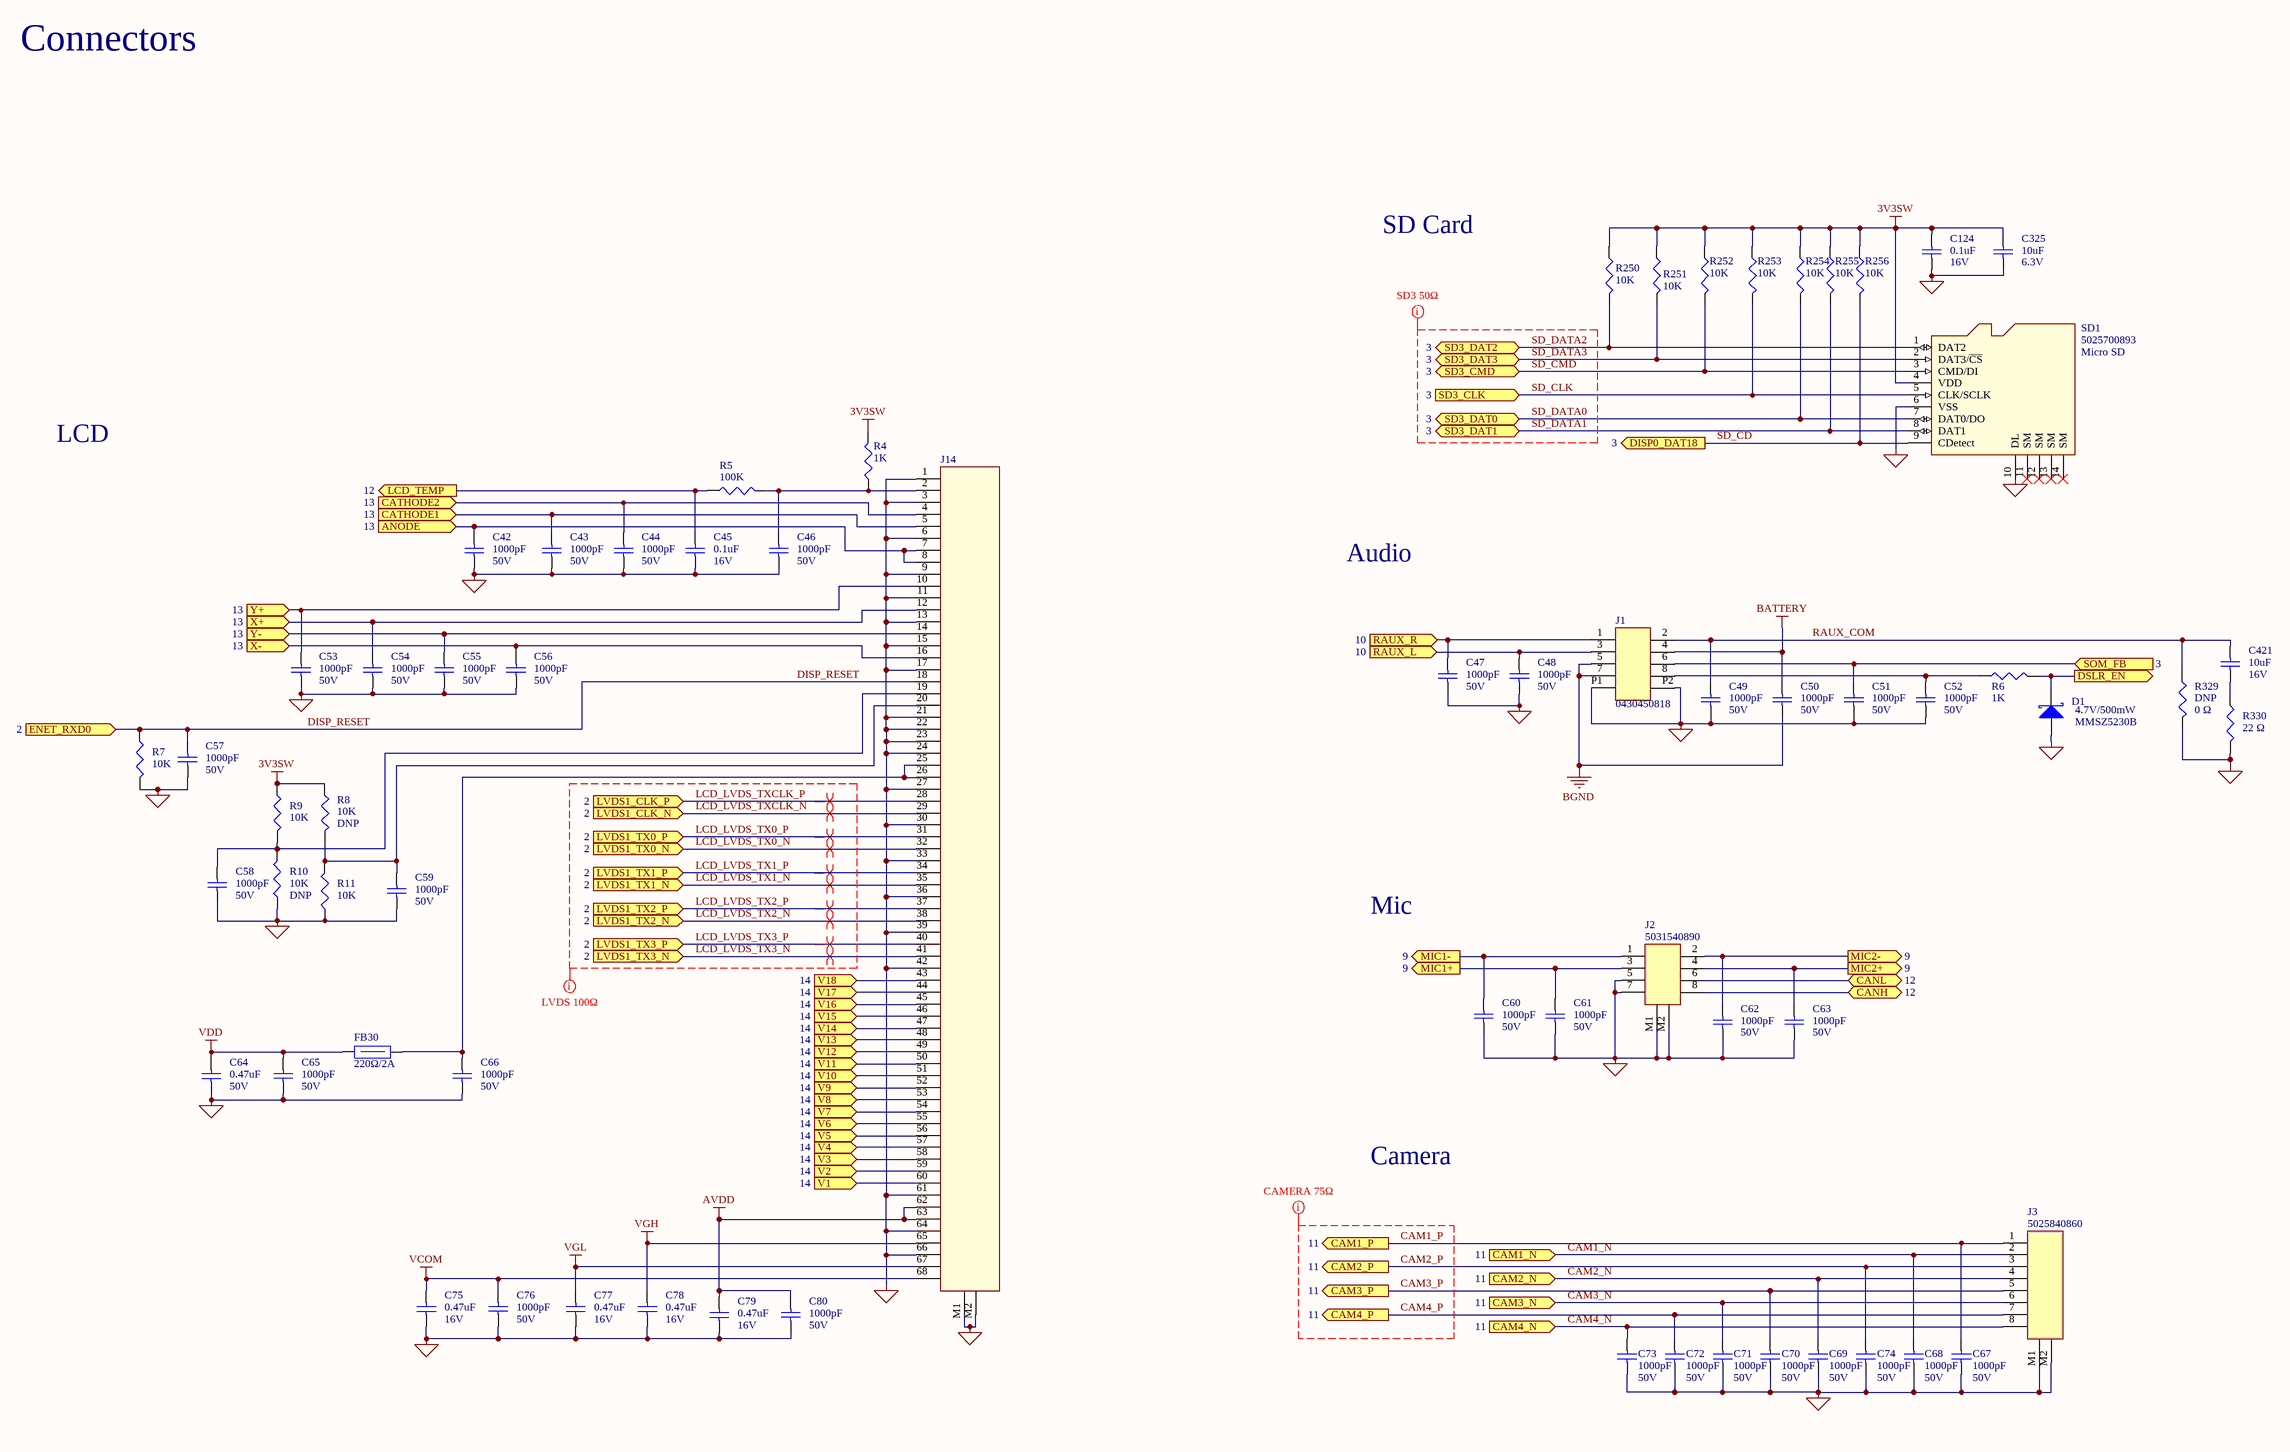
[diagram p3: 4 Connectors.SchDoc]

### Parts
C42  value 1000pF  Voltage: 50V  [CAP_0402]  (hidden comment: Cap 1000pF 50V 0402)
C43  value 1000pF  Voltage: 50V  [CAP_0402]  (hidden comment: Cap 1000pF 50V 0402)
C44  value 1000pF  Voltage: 50V  [CAP_0402]  (hidden comment: Cap 1000pF 50V 0402)
C45  value 0.1uF  Voltage: 16V  [CAP_0402]  (hidden comment: Cap 0.1uF 16V 0402)
C46  value 1000pF  Voltage: 50V  [CAP_0402]  (hidden comment: Cap 1000pF 50V 0402)
C47  value 1000pF  Voltage: 50V  [CAP_0402]  (hidden comment: Cap 1000pF 50V 0402)
C48  value 1000pF  Voltage: 50V  [CAP_0402]  (hidden comment: Cap 1000pF 50V 0402)
C49  value 1000pF  Voltage: 50V  [CAP_0402]  (hidden comment: Cap 1000pF 50V 0402)
C50  value 1000pF  Voltage: 50V  [CAP_0402]  (hidden comment: Cap 1000pF 50V 0402)
C51  value 1000pF  Voltage: 50V  [CAP_0402]  (hidden comment: Cap 1000pF 50V 0402)
C52  value 1000pF  Voltage: 50V  [CAP_0402]  (hidden comment: Cap 1000pF 50V 0402)
C53  value 1000pF  Voltage: 50V  [CAP_0402]  (hidden comment: Cap 1000pF 50V 0402)
C54  value 1000pF  Voltage: 50V  [CAP_0402]  (hidden comment: Cap 1000pF 50V 0402)
C55  value 1000pF  Voltage: 50V  [CAP_0402]  (hidden comment: Cap 1000pF 50V 0402)
C56  value 1000pF  Voltage: 50V  [CAP_0402]  (hidden comment: Cap 1000pF 50V 0402)
C57  value 1000pF  Voltage: 50V  [CAP_0402]  (hidden comment: Cap 1000pF 50V 0402)
C58  value 1000pF  Voltage: 50V  [CAP_0402]  (hidden comment: Cap 1000pF 50V 0402)
C59  value 1000pF  Voltage: 50V  [CAP_0402]  (hidden comment: Cap 1000pF 50V 0402)
C60  value 1000pF  Voltage: 50V  [CAP_0402]  (hidden comment: Cap 1000pF 50V 0402)
C61  value 1000pF  Voltage: 50V  [CAP_0402]  (hidden comment: Cap 1000pF 50V 0402)
C62  value 1000pF  Voltage: 50V  [CAP_0402]  (hidden comment: Cap 1000pF 50V 0402)
C63  value 1000pF  Voltage: 50V  [CAP_0402]  (hidden comment: Cap 1000pF 50V 0402)
C64  value 0.47uF  Voltage: 50V  [CAP_1206]  (hidden comment: Cap 0.47uF 50V 1206)
C65  value 1000pF  Voltage: 50V  [CAP_0402]  (hidden comment: Cap 1000pF 50V 0402)
C66  value 1000pF  Voltage: 50V  [CAP_0402]  (hidden comment: Cap 1000pF 50V 0402)
C67  value 1000pF  Voltage: 50V  [CAP_0402]  (hidden comment: Cap 1000pF 50V 0402)
C68  value 1000pF  Voltage: 50V  [CAP_0402]  (hidden comment: Cap 1000pF 50V 0402)
C69  value 1000pF  Voltage: 50V  [CAP_0402]  (hidden comment: Cap 1000pF 50V 0402)
C70  value 1000pF  Voltage: 50V  [CAP_0402]  (hidden comment: Cap 1000pF 50V 0402)
C71  value 1000pF  Voltage: 50V  [CAP_0402]  (hidden comment: Cap 1000pF 50V 0402)
C72  value 1000pF  Voltage: 50V  [CAP_0402]  (hidden comment: Cap 1000pF 50V 0402)
C73  value 1000pF  Voltage: 50V  [CAP_0402]  (hidden comment: Cap 1000pF 50V 0402)
C74  value 1000pF  Voltage: 50V  [CAP_0402]  (hidden comment: Cap 1000pF 50V 0402)
C75  value 0.47uF  Voltage: 16V  [CAP_0603]  (hidden comment: Cap 0.47uF 16V 0603)
C76  value 1000pF  Voltage: 50V  [CAP_0402]  (hidden comment: Cap 1000pF 50V 0402)
C77  value 0.47uF  Voltage: 16V  [CAP_0603]  (hidden comment: Cap 0.47uF 16V 0603)
C78  value 0.47uF  Voltage: 16V  [CAP_0603]  (hidden comment: Cap 0.47uF 16V 0603)
C79  value 0.47uF  Voltage: 16V  [CAP_0603]  (hidden comment: Cap 0.47uF 16V 0603)
C80  value 1000pF  Voltage: 50V  [CAP_0402]  (hidden comment: Cap 1000pF 50V 0402)
C124  value 0.1uF  Voltage: 16V  [CAP_0402]  (hidden comment: Cap 0.1uF 16V 0402)
C325  value 10uF  Voltage: 6.3V  [CAP_0402]  (hidden comment: Cap 10uF 6.3V 0402)
C421  value 10uF  Voltage: 16V  [CAP_0603]  (hidden comment: Cap 10uF 16V 0603)
D1  MMSZ5230B  value 4.7V/500mW  [SOD-123_MMSZ5230B]
FB30  value 220Ω/2A  [IND_0805]  (hidden comment: BKP2125HS221-T)
J1  0430450818  [CON_0430450818]
J2  5031540890  [CON_5031540890]
J3  5025840860  [CON_5025840860]
J14  FH28E-68S-0.5SH(05)  [CON_FH28E-68S-0.5SH(05)]  (value not drawn)
R4  value 1K  [RES_0402]  (hidden comment: Res 1K 0.063W)
R5  value 100K  [RES_0402]  (hidden comment: Res 100K 0.1W)
R6  value 1K  [RES_0402]  (hidden comment: Res 1K 0.063W)
R7  value 10K  [RES_0402]  (hidden comment: Res 10K 0.063W)
R8  value 10K  [RES_0402]  (hidden comment: Res 10K 0.063W)
R9  value 10K  [RES_0402]  (hidden comment: Res 10K 0.063W)
R10  value 10K  [RES_0402]  (hidden comment: Res 10K 0.063W)
R11  value 10K  [RES_0402]  (hidden comment: Res 10K 0.063W)
R250  value 10K  [RES_0402]  (hidden comment: Res 10K 0.063W)
R251  value 10K  [RES_0402]  (hidden comment: Res 10K 0.063W)
R252  value 10K  [RES_0402]  (hidden comment: Res 10K 0.063W)
R253  value 10K  [RES_0402]  (hidden comment: Res 10K 0.063W)
R254  value 10K  [RES_0402]  (hidden comment: Res 10K 0.063W)
R255  value 10K  [RES_0402]  (hidden comment: Res 10K 0.063W)
R256  value 10K  [RES_0402]  (hidden comment: Res 10K 0.063W)
R329  value 0 Ω  [RES_0402]  (hidden comment: Res 0 ohm 0.1W DNP)
R330  value 22 Ω  [RES_0402]  (hidden comment: Res 22R 0.063W)
SD1  5025700893  value Micro SD  [SD_502570-0893]

### Ports
ANODE (in, see 13), CAM1_N (in, see 11), CAM1_P (out, see 11), CAM2_N (in, see 11), CAM2_P (out, see 11), CAM3_N (in, see 11), CAM3_P (out, see 11), CAM4_N (in, see 11), CAM4_P (out, see 11), CANH (bidir, see 12), CANL (bidir, see 12), CATHODE1 (in, see 13), CATHODE2 (in, see 13), DISP0_DAT18 (out, see 3), DSLR_EN (out), ENET_RXD0 (in, see 2), LCD_TEMP (out, see 12), LVDS1_CLK_N (in, see 2), LVDS1_CLK_P (in, see 2), LVDS1_TX0_N (in, see 2), LVDS1_TX0_P (in, see 2), LVDS1_TX1_N (in, see 2), LVDS1_TX1_P (in, see 2), LVDS1_TX2_N (in, see 2), LVDS1_TX2_P (in, see 2), LVDS1_TX3_N (in, see 2), LVDS1_TX3_P (in, see 2), MIC1+ (out, see 9), MIC1- (out, see 9), MIC2+ (out, see 9), MIC2- (out, see 9), RAUX_L (in, see 10), RAUX_R (in, see 10), SD3_CLK (in, see 3), SD3_CMD (bidir, see 3), SD3_DAT0 (bidir, see 3), SD3_DAT1 (bidir, see 3), SD3_DAT2 (bidir, see 3), SD3_DAT3 (bidir, see 3), SOM_FB (in, see 3), V1 (in, see 14), V2 (in, see 14), V3 (in, see 14), V4 (in, see 14), V5 (in, see 14), V6 (in, see 14), V7 (in, see 14), V8 (in, see 14), V9 (in, see 14), V10 (in, see 14), V11 (in, see 14), V12 (in, see 14), V13 (in, see 14), V14 (in, see 14), V15 (in, see 14), V16 (in, see 14), V17 (in, see 14), V18 (in, see 14), X+ (in, see 13), X- (in, see 13), Y+ (in, see 13), Y- (in, see 13)

### Nets
3V3SW: C124.1 C325.1 R4.2 R8.1 R9.1 R250.1 R251.1 R252.1 R253.1 R254.1 R255.1 R256.1 SD1.4(VDD)
AVDD: C79.1 C80.1 J14.62 J14.63
BATTERY: C50.1 J1.4
BGND: C50.2 J1.5 J1.7
GND: C42.2 C43.2 C44.2 C45.2 C46.2 C47.2 C48.2 C49.2 C51.2 C52.2 C53.2 C54.2 C55.2 C56.2 C57.2 C58.2 C59.2 C60.2 C61.2 C62.2 C63.2 C64.2 C65.2 C66.2 C67.2 C68.2 C69.2 C70.2 C71.2 C72.2 C73.2 C74.2 C75.2 C76.2 C77.2 C78.2 C79.2 C80.2 C124.2 C325.2 D1.A J1.P1 J1.P2 J2.5 J2.7 J2.M1 J2.M2 J3.M1 J3.M2 J14.1 J14.3 J14.6 J14.9 J14.11 J14.13 J14.15 J14.17 J14.21 J14.22 J14.23 J14.24 J14.27 J14.30 J14.33 J14.36 J14.39 J14.42 J14.61 J14.64 J14.66 J14.M1 J14.M2 R7.2 R10.1 R11.1 R329.2 R330.2 SD1.6(VSS) SD1.10(DL)
VCOM: C75.1 C76.1 J14.68
VDD: C64.1 C65.1 FB30.1
VGH: C78.1 J14.65
VGL: C77.1 J14.67
CAM1_N: C68.1 J3.2 ; port CAM1_N
CAM1_P: C67.1 J3.1 ; port CAM1_P
CAM2_N: C69.1 J3.4 ; port CAM2_N
CAM2_P: C74.1 J3.3 ; port CAM2_P
CAM3_N: C71.1 J3.6 ; port CAM3_N
CAM3_P: C70.1 J3.5 ; port CAM3_P
CAM4_N: C73.1 J3.8 ; port CAM4_N
CAM4_P: C72.1 J3.7 ; port CAM4_P
CAN_N: J2.6 ; port CANL
CAN_P: J2.8 ; port CANH
DISP_RESET: C57.1 J14.18 R7.1 ; port ENET_RXD0
LCD_LVDS_TX0_N: J14.32 ; port LVDS1_TX0_N
LCD_LVDS_TX0_P: J14.31 ; port LVDS1_TX0_P
LCD_LVDS_TX1_N: J14.35 ; port LVDS1_TX1_N
LCD_LVDS_TX1_P: J14.34 ; port LVDS1_TX1_P
LCD_LVDS_TX2_N: J14.38 ; port LVDS1_TX2_N
LCD_LVDS_TX2_P: J14.37 ; port LVDS1_TX2_P
LCD_LVDS_TX3_N: J14.41 ; port LVDS1_TX3_N
LCD_LVDS_TX3_P: J14.40 ; port LVDS1_TX3_P
LCD_LVDS_TXCLK_N: J14.29 ; port LVDS1_CLK_N
LCD_LVDS_TXCLK_P: J14.28 ; port LVDS1_CLK_P
MIC1+: C61.1 J2.3 ; port MIC1+
MIC1-: C60.1 J2.1 ; port MIC1-
MIC2+: C63.1 J2.4 ; port MIC2+
MIC2-: C62.1 J2.2 ; port MIC2-
RAUX_COM: C49.1 C421.1 J1.2 R329.1
SD_CD: R256.2 SD1.9(CDetect) ; port DISP0_DAT18
SD_CLK: R253.2 SD1.5(CLK/SCLK) ; port SD3_CLK
SD_CMD: R252.2 SD1.3(CMD/DI) ; port SD3_CMD
SD_DATA0: R254.2 SD1.7(DAT0/DO) ; port SD3_DAT0
SD_DATA1: R255.2 SD1.8(DAT1) ; port SD3_DAT1
SD_DATA2: R250.2 SD1.1(DAT2) ; port SD3_DAT2
SD_DATA3: R251.2 SD1.2(DAT3/~{CS}) ; port SD3_DAT3
NetC42_1: C42.1 J14.7 J14.8 ; port ANODE
NetC43_1: C43.1 J14.5 ; port CATHODE1
NetC44_1: C44.1 J14.4 ; port CATHODE2
NetC45_1: C45.1 R5.1 ; port LCD_TEMP
NetC46_1: C46.1 J14.2 R4.1 R5.2
NetC47_1: C47.1 J1.1 ; port RAUX_R
NetC48_1: C48.1 J1.3 ; port RAUX_L
NetC51_1: C51.1 J1.6 ; port SOM_FB
NetC52_1: C52.1 J1.8 R6.1
NetC53_1: C53.1 J14.10 ; port Y+
NetC54_1: C54.1 J14.12 ; port X+
NetC55_1: C55.1 J14.14 ; port Y-
NetC56_1: C56.1 J14.16 ; port X-
NetC58_1: C58.1 J14.19 R9.2 R10.2
NetC59_1: C59.1 J14.20 R8.2 R11.2
NetC66_1: C66.1 FB30.2 J14.25 J14.26
NetC265_1: J14.60 ; port V1
NetC266_1: J14.59 ; port V2
NetC267_1: J14.58 ; port V3
NetC270_1: J14.57 ; port V4
NetC273_1: J14.56 ; port V5
NetC274_1: J14.55 ; port V6
NetC278_1: J14.54 ; port V7
NetC279_1: J14.53 ; port V8
NetC281_1: J14.52 ; port V9
NetC283_1: J14.51 ; port V10
NetC288_1: J14.50 ; port V11
NetC290_1: J14.49 ; port V12
NetC293_1: J14.48 ; port V13
NetC297_1: J14.47 ; port V14
NetC300_1: J14.46 ; port V15
NetC304_1: J14.45 ; port V16
NetC306_1: J14.44 ; port V17
NetC307_1: J14.43 ; port V18
NetC421_2: C421.2 R330.1
NetD1_K: D1.K R6.2 ; port DSLR_EN

Not connected (* = marked no-connect by the designer): SD1 11(SM)* 12(SM)* 13(SM)* 14(SM)*

### Layout directives
net class SD3 50ohm: SD_CLK, SD_CMD, SD_DATA0, SD_DATA1, SD_DATA2, SD_DATA3
net class CAMERA 75ohm: CAM1_P, CAM2_P, CAM3_P, CAM4_P
differential pair: LCD_LVDS_TX0_N, LCD_LVDS_TX0_P, LCD_LVDS_TX1_N, LCD_LVDS_TX1_P, LCD_LVDS_TX2_N, LCD_LVDS_TX2_P, LCD_LVDS_TX3_N, LCD_LVDS_TX3_P, LCD_LVDS_TXCLK_N, LCD_LVDS_TXCLK_P
net class LVDS 100ohm: LCD_LVDS_TX0_N, LCD_LVDS_TX0_P, LCD_LVDS_TX1_N, LCD_LVDS_TX1_P, LCD_LVDS_TX2_N, LCD_LVDS_TX2_P, LCD_LVDS_TX3_N, LCD_LVDS_TX3_P, LCD_LVDS_TXCLK_N, LCD_LVDS_TXCLK_P

### Notes on the sheet
- Connectors
- SD Card
- LCD
- Audio
- Mic
- Camera
- First View Consultants
- Austin, Tx
- 512.582.9102
- firstviewconsultants.com
- Title:
- File:
- Drawn:
- Sheet
- of
- FVC #:
- Checked:
- Approved:
- Date:
- Page Size:
- C
- Rev.
- Time:

### Library data of the parts
C42-C44 C46-C63 C65-C74 C76 C80 = Cap 1000pF 50V 0402: as C22 on sheet 2 MXM Connector 1; Tolerance: 20%; PACKAGE: 0402
C45 C124 = Cap 0.1uF 16V 0402: as C338 on sheet 3 MXM Connector 2; Package: 0402; Tolerance: ±10%
C64 = Cap 0.47uF 50V 1206: Cap, Cer, 0.47uF, 50V, 10%, X7R, 1206; Manufacturer: Yageo; Manufacturer #: CC1206KKX7R9BB474; Have Footprint: yes; Package: 1206; Tolerance: 10%
C75 C77-C79 = Cap 0.47uF 16V 0603: Cap, Cer, 0.47uF, 16V, 10%, X8R, 0603; Manufacturer: TDK Corporation; Manufacturer #: CGA3E3X8R1C474K080AD; Have Footprint: yes; Package: 0603; Tolerance: 10%
C325 = Cap 10uF 6.3V 0402: Cap, Cer, 10uF, 6.3V, 20%, X5R, 0402; Manufacturer #: CL05A106MQ5NUNC; Manufacturer: Samsung Electro-Mechanics America, Inc; Have Footprint: yes; RoHS: yes; Tolerance: ±20%; Operating Temperature: -55°C ~ 85°C; Package: 0402
C421 = Cap 10uF 16V 0603: Cap, Cer, 10uF, 16V, 20%, X5R, 0603; Manufacturer #: GRM188C81C106MA73D; Manufacturer: Murata Electronics North America; Have Footprint: yes; RoHS: yes; Tolerance: ±20%; Operating Temperature: -55°C ~ 85°C; Package: 0603
D1 = MMSZ5230B: Diode, Zener, 4.7V, 500mW, SOD-123; Manufacturer: Diodes Incorporated; Package: SOD-123; Manufacturer #: MMSZ5230B
FB30 = BKP2125HS221-T: Ind, Ferrite Bead, 220R, 50mOhm, 2A, 0805; Manufacturer: Taiyo Yuden; Manufacturer #: BKP2125HS221-T; Package: 0805
J1 = 0430450818: Conn, Header, 8 pos, 3mm pitch, SMD; Manufacturer: Molex Inc; Manufacturer #: 0430450818
J2 = 5031540890: Conn, Receptacle, 8 pos, 1.5mm pitch, SMD; Manufacturer: Molex Inc; Have Footprint: yes; Manufacturer #: 5031540890
J3 = 5025840860: Conn, Receptacle, 8 pos, 1.5mm pitch, SMD; Manufacturer: Molex Inc; Have Footprint: yes; Manufacturer #: 5025840860
J14 = FH28E-68S-0.5SH(05): Conn, FPC/FFC, 68Pos, .5MM, Horz., SMD; Manufacturer: Hirose Electric Co Ltd; Have Footprint: yes; RoHS: yes; Operating Temperature: -55°C ~ 85°C; Manufacturer #: FH28E-68S-0.5SH(05)
R4 R6 = Res 1K 0.063W: Res, 1K, 0.063W, 1%, 0402; Manufacturer #: CRCW04021K00FKED; Manufacturer: Vishay Dale; Have Footprint: yes; Package: 0402; Tolerance: ±1%
R5 = Res 100K 0.1W: Res, 100K, 0.1W, 1%, 0402; Manufacturer #: ERJ-2RKF1003X; Manufacturer: Panasonic Electronic Components; Have Footprint: yes; Package: 0402
R7-R11 R250-R256 = Res 10K 0.063W: as R327 on sheet 2 MXM Connector 1; Package: 0402
  R8 R10: DNP: DNP
R329 = Res 0 ohm 0.1W DNP: Res, 0 ohm, 1/16W, 0402; Manufacturer #: CRCW04020000Z0ED; Manufacturer: Vishay Dale; Have Footprint: yes; Package: 0402; DNP: DNP
R330 = Res 22R 0.063W: Res, 22R, 0.063W, 1%, 0402; Manufacturer #: RC0402FR-0722RL; Manufacturer: Yageo; Have Footprint: yes; Tolerance: ±1%; RoHS: yes; Cost: *; Package: 0402
SD1 = 5025700893: Conn, Mico SD, RT, SMD; Manufacturer: Molex Inc; Have Footprint: yes; Manufacturer #: 5025700893